# EAGLE design Master (EAGLE 8.2.2)
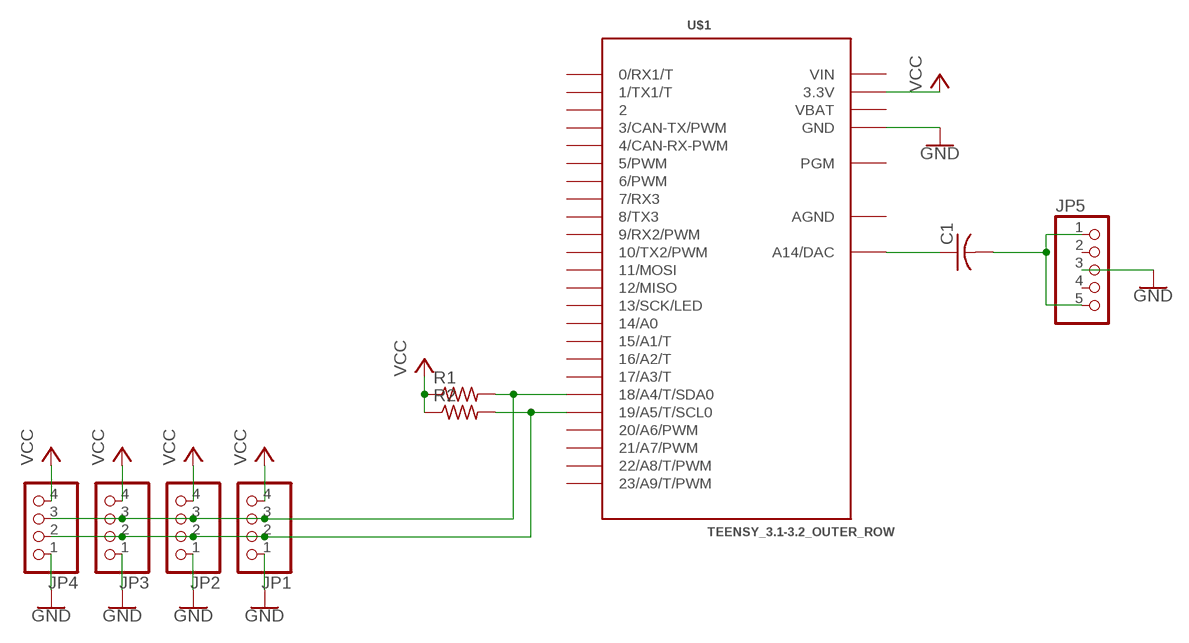
[diagram p0: schematic, sheet 1]

## Parts
C1  C-US025-030X050  [C025-030X050]
JP1  PINHD-1X4  [1X04]
JP2  PINHD-1X4  [1X04]
JP3  PINHD-1X4  [1X04]
JP4  PINHD-1X4  [1X04]
JP5  PINHD-1X5  [1X05]
R1  R-US_0207/7  [0207/7]
R2  R-US_0207/7  [0207/7]
U$1  TEENSY_3.1-3.2_OUTER_ROW  [TEENSY_3.0-3.2&LC_OUTER_ROW]

## Nets
GND: JP1.1 JP2.1 JP3.1 JP4.1 JP5.3 U$1.GND U$1.GND1(GND)
N$1: JP1.3 JP2.3 JP3.3 JP4.3 R1.2 U$1.18/A4(18/A4/T/SDA0)
N$2: JP1.2 JP2.2 JP3.2 JP4.2 R2.2 U$1.19/A5(19/A5/T/SCL0)
N$3: C1.1 U$1.RESET/DAC(A14/DAC)
N$4: C1.2 JP5.1 JP5.5
VCC: JP1.4 JP2.4 JP3.4 JP4.4 R1.1 R2.1 U$1.3.3V U$1.3.3V1(3.3V)
Unconnected: JP5.2 JP5.4 U$1.0(0/RX1/T) U$1.1(1/TX1/T) U$1.2 U$1.3(3/CAN-TX/PWM) U$1.4(4/CAN-RX-PWM) U$1.5(5/PWM) U$1.6(6/PWM) U$1.7(7/RX3) U$1.8(8/TX3) U$1.9(9/RX2/PWM) U$1.10(10/TX2/PWM) U$1.11(11/MOSI) U$1.12(12/MISO) U$1.13(13/SCK/LED) U$1.14/A0 U$1.15/A1(15/A1/T) U$1.16/A2(16/A2/T) U$1.17/A3(17/A3/T) U$1.20/A6(20/A6/PWM) U$1.21/A7(21/A7/PWM) U$1.22/A8(22/A8/T/PWM) U$1.23/A9(23/A9/T/PWM) U$1.PGM

## Power pins joined to a net without a drawn wire
AGND: U$1.AGND
VBAT: U$1.VBAT
VIN: U$1.VIN

## Library data of the parts
C1 = rcl:C-US: CAPACITOR, American symbol
JP1-JP4 = pinhead:PINHD-1X4: PIN HEADER
JP5 = pinhead:PINHD-1X5: PIN HEADER
R1 R2 = rcl:R-US_: RESISTOR, American symbol
U$1 = Teensy_3_and_LC_Series_Boards_v1.4:TEENSY_3.1-3.2_OUTER_ROW: Footprint for Teensy 3.1 or 3.2 board using all pin connections on the outer perimeter

## Board
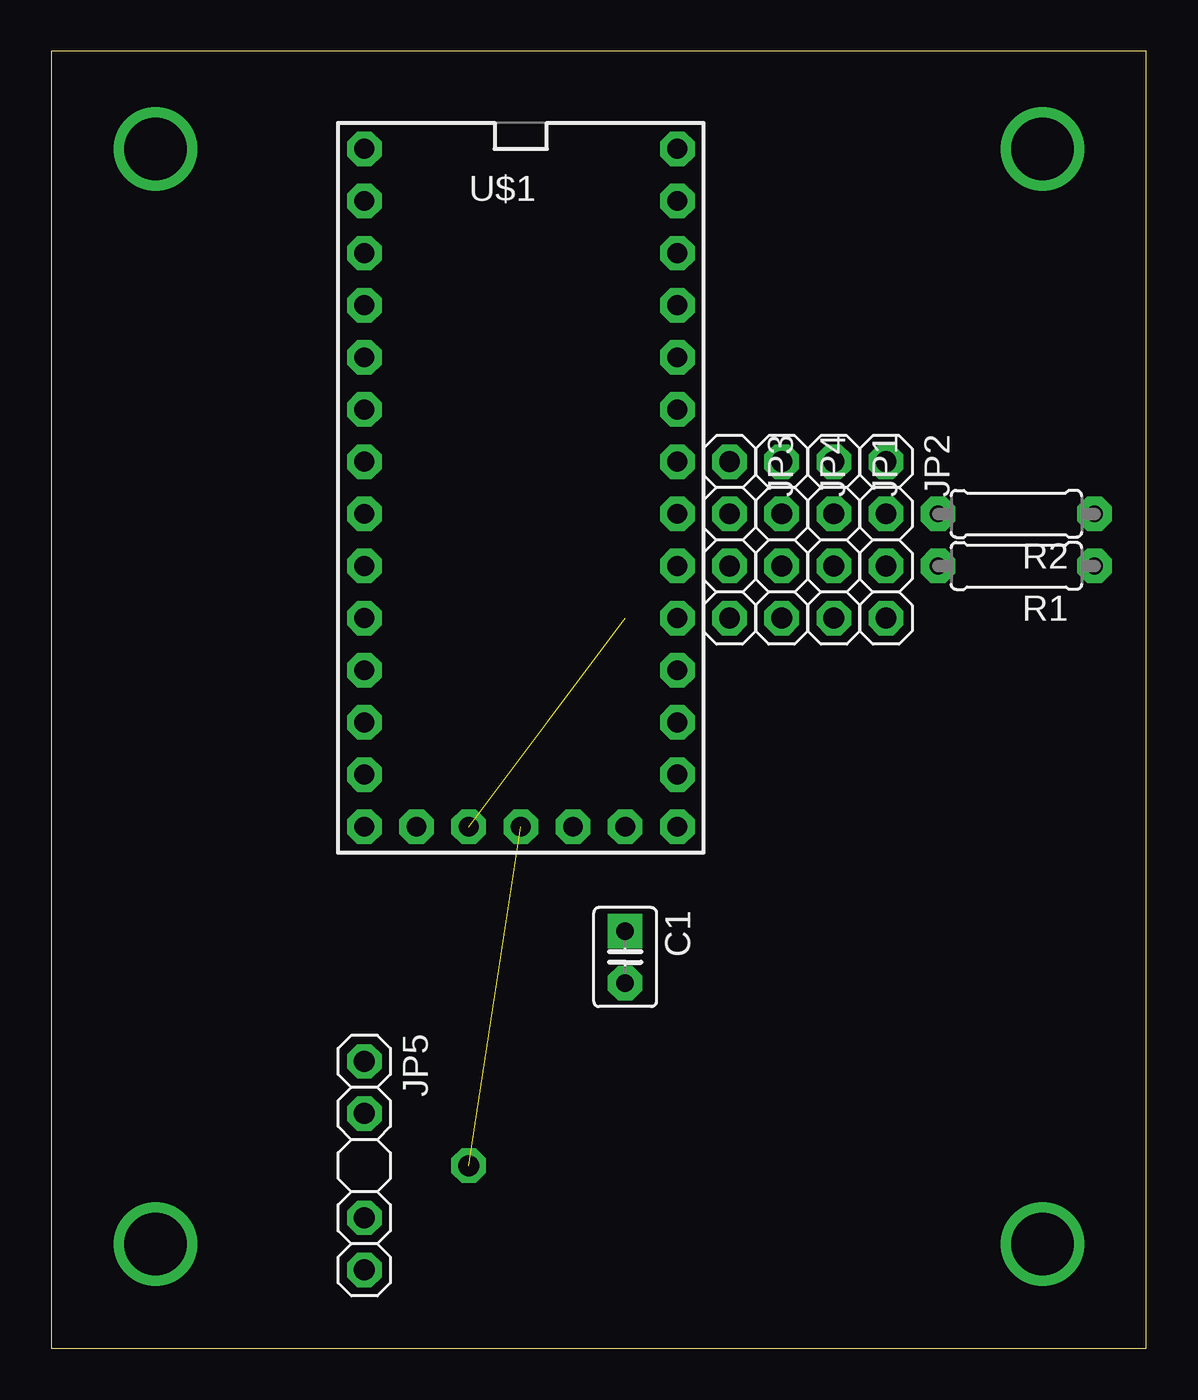
[diagram p1: board, top side]
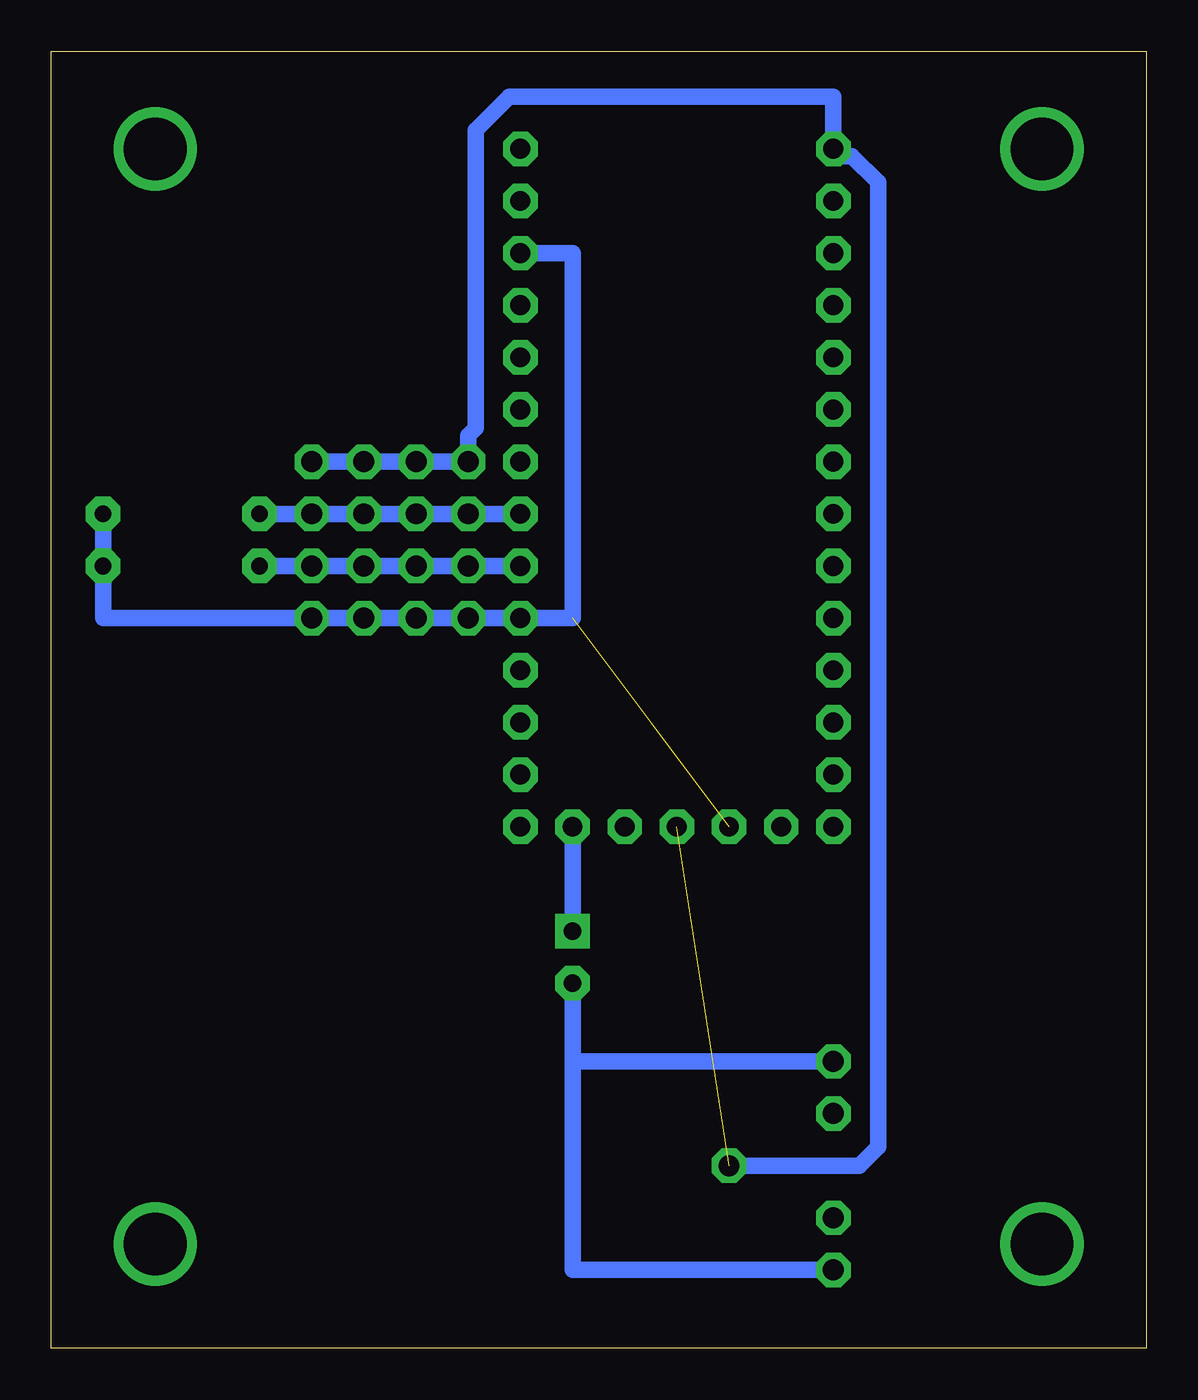
[diagram p2: board, bottom side, seen from below]

Size 53.32 x 63.17 mm. Coordinates in mm from the lower left corner, seen from the top.
Outline: 0,0 53.32,0 53.32,63.17 0,63.17 0,0
Copper layers (1*16): Top 0.035mm / dielectric 1.5mm / Bottom 0.035mm
Design rules "default *": minimum track width 6mil, minimum drill 0.35mm, track to track 32mil, track to pad 32mil, pad to pad 32mil, via to via 32mil, smd to smd 32mil, copper to edge 40mil, drill to drill 6mil, minimum pad ring 10mil, minimum via ring 8mil, stop-mask expansion 4mil, vias tented up to drill 0mil, thermal gap 10mil

### Footprints (pad centres in the part's own frame; a part is rotated, then mirrored left to right if it is on the bottom)
C025-030X050 = drill 0.85 pad 1.676 square: 1 -1.27,0 | drill 0.85 pad 1.676 octagon: 2 1.27,0
1X04 = drill 1.016 pad 1.676 octagon: 1 -3.81,0; 2 -1.27,0; 3 1.27,0; 4 3.81,0
1X05 = drill 1.016 pad 1.676 octagon: 1 -5.08,0; 2 -2.54,0; 3 0,5.08; 4 2.54,0; 5 5.08,0
0207/7 = drill 0.813 pad 1.676 octagon: 1 -3.81,0; 2 3.81,0
TEENSY_3.0-3.2&LC_OUTER_ROW = drill 0.965 pad 1.676 octagon: 0 -7.62,13.97; 1 -7.62,11.43; 2 -7.62,8.89; 3 -7.62,6.35; 3.3V 7.62,11.43; 3.3V1 -2.54,-16.51; 4 -7.62,3.81; 5 -7.62,1.27; 6 -7.62,-1.27; 7 -7.62,-3.81; 8 -7.62,-6.35; 9 -7.62,-8.89; 10 -7.62,-11.43; 11 -7.62,-13.97; 12 -7.62,-16.51; 13 7.62,-16.51; 14/A0 7.62,-13.97; 15/A1 7.62,-11.43; 16/A2 7.62,-8.89; 17/A3 7.62,-6.35; 18/A4 7.62,-3.81; 19/A5 7.62,-1.27; 20/A6 7.62,1.27; 21/A7 7.62,3.81; 22/A8 7.62,6.35; 23/A9 7.62,8.89; AGND 7.62,13.97; GND -7.62,16.51; GND1 0,-16.51; PGM 2.54,-16.51; RESET/DAC 5.08,-16.51; VBAT -5.08,-16.51; VIN 7.62,16.51

### Placement (x,y rotation side)
C1  27.94,19.05 270 top
JP1  38.1,39.37 270 top
JP2  40.64,39.37 270 top
JP3  33.02,39.37 270 top
JP4  35.56,39.37 270 top
JP5  15.24,8.89 270 top
R1  46.99,38.1 180 top
R2  46.99,40.64 180 top
U$1  22.86,41.91 0 top

### Tracks (layer width: path | path; a pad name or v marks a point on that pad's centre or on a via)
GND  (1 unrouted)
  Bottom 0.813: JP2.1 JP1.1 JP4.1 JP3.1 33.02,44.45 32.66,44.81 32.66,59.33 31.03,60.96 15.24,60.96 U$1.GND 14.88,58.06 14.34,58.06 13.06,56.78 13.06,9.8 13.97,8.89 JP5.3
N$1
  Bottom 0.813: U$1.18/A4 JP3.3 JP4.3 JP1.3 JP2.3 R1.2
N$2
  Bottom 0.813: U$1.19/A5 JP3.2 JP4.2 JP1.2 JP2.2 R2.2
N$3
  Bottom 0.813: C1.1 U$1.RESET/DAC
N$4
  Bottom 0.813: 27.94,13.97 JP5.1 | JP5.5 27.94,3.81 27.94,13.97 | C1.2 27.94,13.97
N$5  (via drill 3.05)
  other vias: 48.26,58.42
N$6  (via drill 3.05)
  other vias: 48.26,5.08
N$7  (via drill 3.05)
  other vias: 5.08,58.42
N$8  (via drill 3.05)
  other vias: 5.08,5.08
VCC  (1 unrouted)
  Bottom 0.813: R2.1 R1.1 50.8,35.56 JP2.4 JP1.4 JP4.4 JP3.4 27.94,35.56 27.94,53.34 U$1.3.3V